# EAGLE design duobackpane (EAGLE 7.7.0)
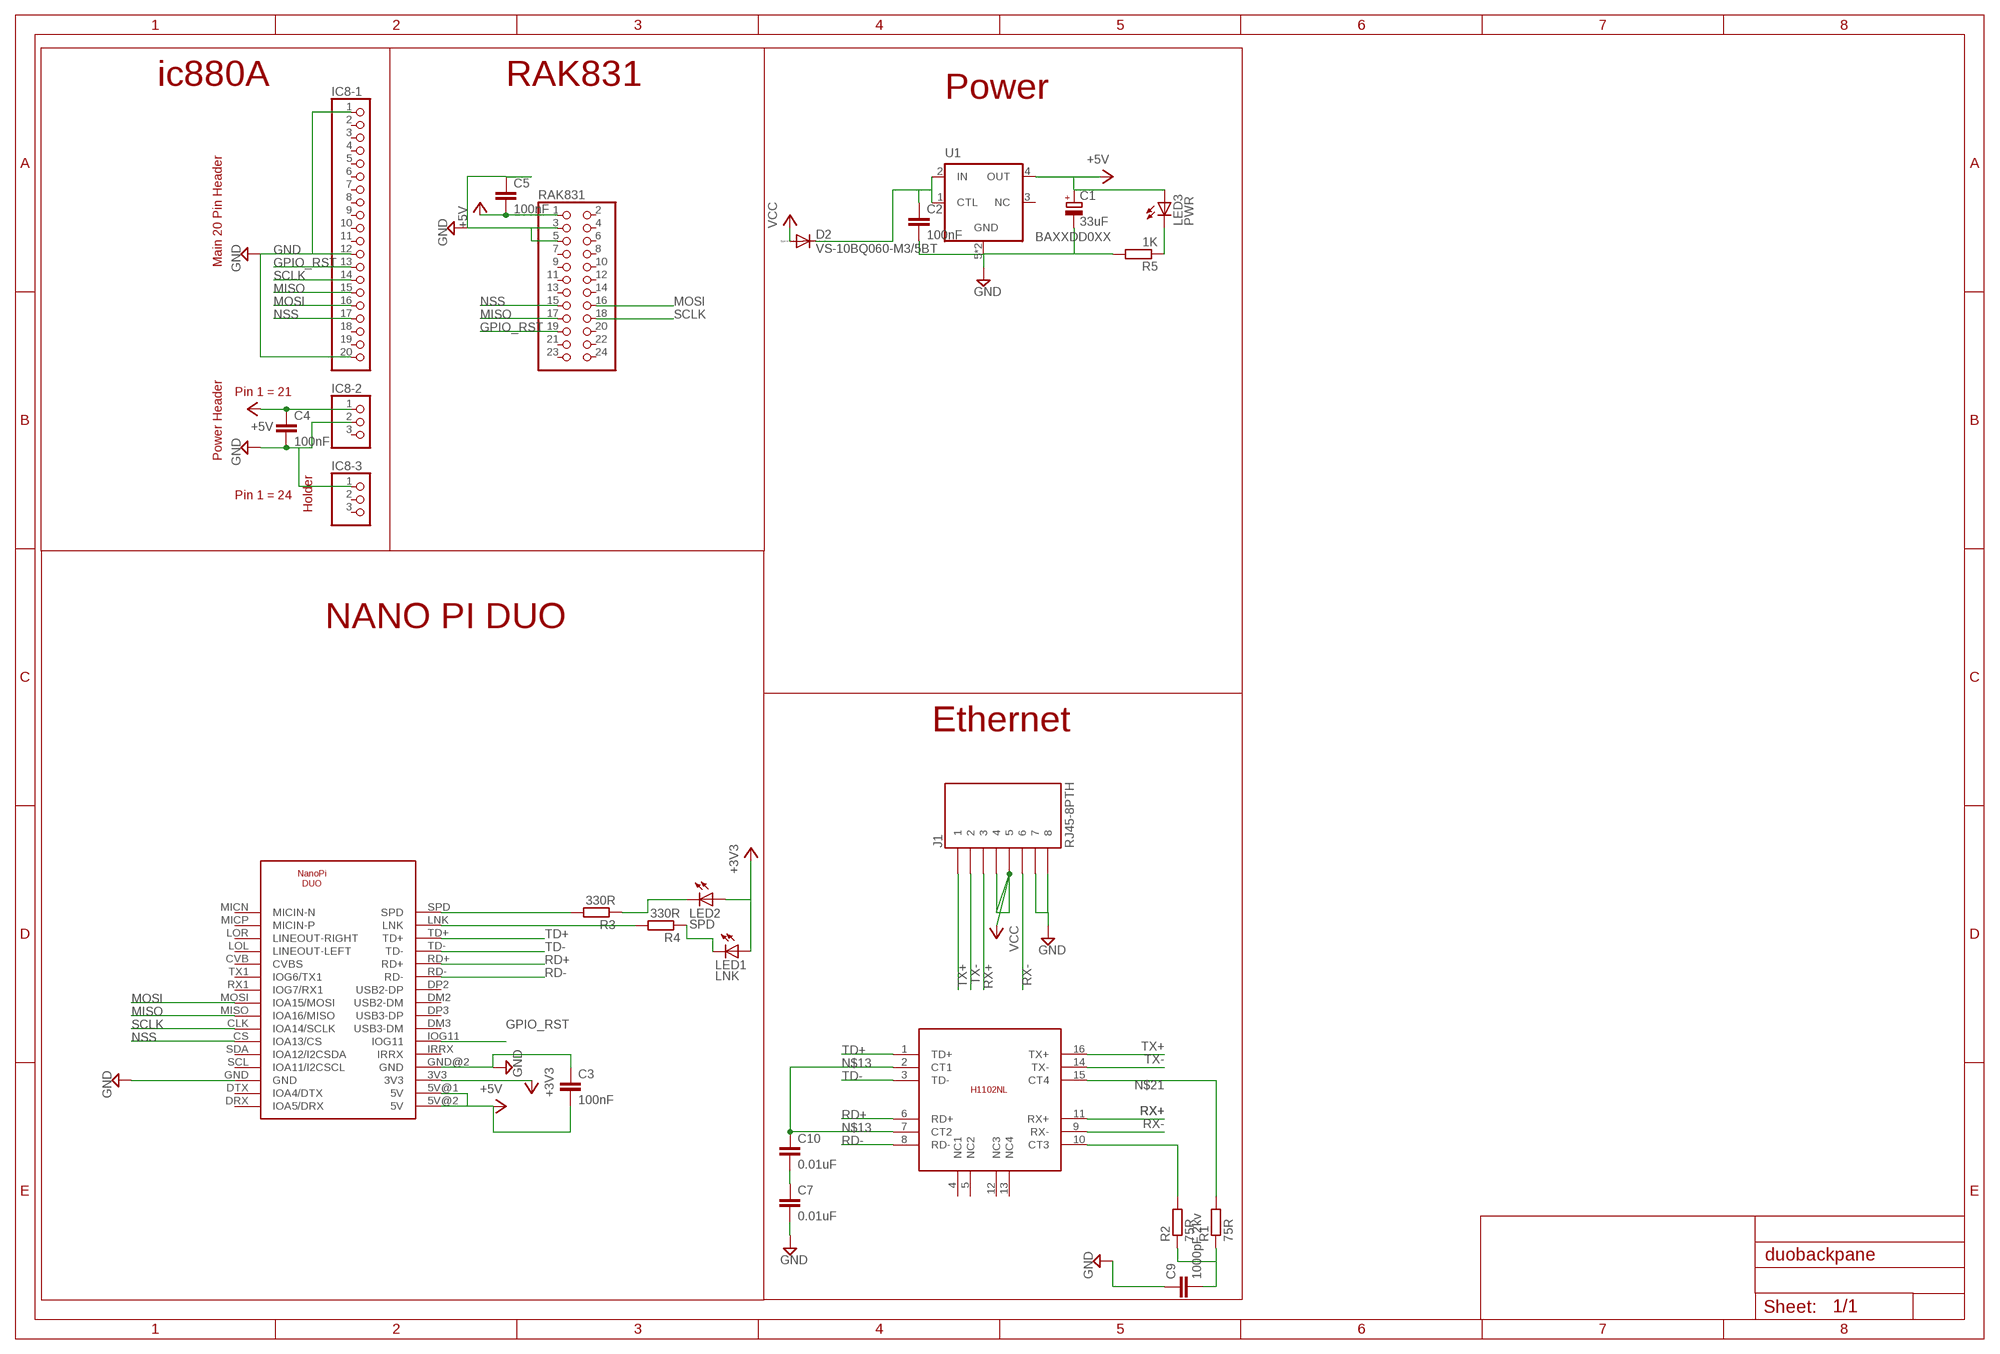
[diagram p0: schematic, sheet 1]

## Parts
C1  33uF  CPOL-EUSMCA  [SMC_A]
C2  100nF  C-EUC0805  [C0805]
C3  100nF  C-EUC0805  [C0805]
C4  100nF  C-EUC0805  [C0805]
C5  100nF  C-EUC0805  [C0805]
C7  0.01uF  C-EUC0805  [C0805]
C9  1000pF 2kv  C-EUC1206  [C1206]
C10  0.01uF  C-EUC0805  [C0805]
D2  VS-10BQ060-M3/5BT  DIODE-DO214AA  [DO214AA]
IC8-1  PINHD-1X20  [1X20]
IC8-2  PINHD-1X3  [1X03]
IC8-3  PINHD-1X3  [1X03]
J1  RJ45-8PTH  [RJ45-8]
LED1  LNK  LEDSML1206  [SML1206]
LED2  SPD  LEDSML1206  [SML1206]
LED3  PWR  LEDSML1206  [SML1206]
R1  75R  R-EU_R0805  [R0805]
R2  75R  R-EU_R0805  [R0805]
R3  330R  R-EU_R0805  [R0805]
R4  330R  R-EU_R0805  [R0805]
R5  1K  R-EU_R0805  [R0805]
RAK831  PINHD-2X12  [2X12]
U1  BAXXDD0XX  [HRP5]
U$1  DECADE-H1102NL  [DECADE-H1102NL]
U$2  NANOPIDUO  [NANOPIDUO]

## Nets
+3V3: LED1.A LED2.A U$2.3V3
+5V: C1.+ C3.2 C4.1 C5.2 IC8-2.1 LED3.A RAK831.1 U1.4(OUT) U$2.5V@1(5V) U$2.5V@2(5V)
GND: C1.- C2.2 C3.1 C4.2 C5.1 C7.2 C9.1 IC8-1.1 IC8-1.12 IC8-1.20 IC8-2.2 IC8-3.1 J1.7 J1.8 R5.2 RAK831.3 RAK831.5 U1.5(GND) U1.6(GND) U$2.GND U$2.GND@2(GND)
GPIO_RST: IC8-1.13 RAK831.19 U$2.IOG11
MISO: IC8-1.15 RAK831.17 U$2.MISO(IOA16/MISO)
MOSI: IC8-1.16 RAK831.16 U$2.MOSI(IOA15/MOSI)
N$1: C2.1 D2.C U1.1(CTL) U1.2(IN)
N$2: R3.2 U$2.SPD
N$3: R4.2 U$2.LNK
N$4: LED2.C R3.1
N$5: R2.2 U$1.10(CT3)
N$6: C9.2 R1.1 R2.1
N$7: LED1.C R4.1
N$8: C7.1 C10.2
N$9: LED3.C R5.1
N$13: C10.1 U$1.2(CT1) U$1.7(CT2)
N$21: R1.2 U$1.15(CT4)
NSS: IC8-1.17 RAK831.15 U$2.CS(IOA13/CS)
RD+: U$1.6(RD+) U$2.RD+
RD-: U$1.8(RD-) U$2.RD-
RX+: J1.3 U$1.11(RX+)
RX-: J1.6 U$1.9(RX-)
SCLK: IC8-1.14 RAK831.18 U$2.CLK(IOA14/SCLK)
TD+: U$1.1(TD+) U$2.TD+
TD-: U$1.3(TD-) U$2.TD-
TX+: J1.1 U$1.16(TX+)
TX-: J1.2 U$1.14(TX-)
VCC: D2.A J1.4 J1.5
Unconnected: IC8-1.2 IC8-1.3 IC8-1.4 IC8-1.5 IC8-1.6 IC8-1.7 IC8-1.8 IC8-1.9 IC8-1.10 IC8-1.11 IC8-1.18 IC8-1.19 IC8-2.3 IC8-3.2 IC8-3.3 RAK831.2 RAK831.4 RAK831.6 RAK831.7 RAK831.8 RAK831.9 RAK831.10 RAK831.11 RAK831.12 RAK831.13 RAK831.14 RAK831.20 RAK831.21 RAK831.22 RAK831.23 RAK831.24 U1.3(NC) U$1.4(NC1) U$1.5(NC2) U$1.12(NC3) U$1.13(NC4) U$2.CVB(CVBS) U$2.DM2(USB2-DM) U$2.DM3(USB3-DM) U$2.DP2(USB2-DP) U$2.DP3(USB3-DP) U$2.DRX(IOA5/DRX) U$2.DTX(IOA4/DTX) U$2.IRRX U$2.LOL(LINEOUT-LEFT) U$2.LOR(LINEOUT-RIGHT) U$2.MICN(MICIN-N) U$2.MICP(MICIN-P) U$2.RX1(IOG7/RX1) U$2.SCL(IOA11/I2CSCL) U$2.SDA(IOA12/I2CSDA) U$2.TX1(IOG6/TX1)

## Notes on the sheet
- ic880A | RAK831
- Power
- Main 20 Pin Header
- Pin 1 = 21
- Power Header
- Pin 1 = 24
- Holder
- NANO PI DUO
- Ethernet

## Library data of the parts
C1 = resistor:CPOL-EU: POLARIZED CAPACITOR, European symbol
C2-C5 C7 C9 C10 = resistor:C-EU: CAPACITOR, European symbol
D2 = diode:DIODE-: DIODE
IC8-1 = pinhead:PINHD-1X20: PIN HEADER
IC8-2 IC8-3 = pinhead:PINHD-1X3: PIN HEADER
J1 = decade:RJ45-8: RJ45 Jack Simple RJ45, 8-pin connection - connector for common Cat5, Cat5e, and Cat6 Ethernet cables. Footprint not yet proven in production. Connector sku is PRT-00643; Breakout PCB sku is BOB-00716.
LED1-LED3 = led:LED: LED OSRAM: - CHIPLED LG R971, LG N971, LY N971, LG Q971, LY Q971, LO R971, LY R971 LH N974, LH R974 LS Q976, LO Q976, LY Q976 LO Q996 - Hyper CHIPLED LW Q18S LB Q993, LB Q99A, LB R99A - SideLED LS A670, LO A670, LY A670, LG A670, LP A670 LB A673, LV A673, LT A673, LW A673 LH A674 LY A675 LS A676, LA A676, LO A676, LY A676, LW A676 LS A679, LY A679, LG A679 - Hyper Micro SIDELED® LS Y876, LA Y876, LO Y876, LY Y876 LT Y87S - SmartLED LW L88C, LW L88S LB L89C, LB L89S, LG L890 LS L89K, LO L89K, LY L89K LS L896, LA L896, LO L896, LY L896 - TOPLED LS T670, LO T670, LY T670, LG T670, LP T670 LSG T670, LSP T670, LSY T670, LOP T670, LYG T670 LG T671, LOG T671, LSG T671 LB T673, LV T673, LT T673, LW T673 LH T674 LS T676, LA T676, LO T676, LY T676, LB T676, LH T676, LSB T676, LW T676 LB T67C, LV T67C, LT T67C, LS T67K, LO T67K, LY T67K, LW E67C LS E67B, LA E67B, LO E67B, LY E67B, LB E67C, LV E67C, LT E67C LW T67C LS T679, LY T679, LG T679 LS T770, LO T770, LY T770, LG T770, LP T770 LB T773, LV T773, LT T773, LW T773 LH T774 LS E675, LA E675, LY E675, LS T675 LS T776, LA T776, LO T776, LY T776, LB T776 LHGB T686 LT T68C, LB T68C - Hyper Mini TOPLED® LB M676 - Mini TOPLED Santana® LG M470 LS M47K, LO M47K, LY M47K Source: http://www.osram.convergy.de LUXEON: - LUMILED® LXK2-PW12-R00, LXK2-PW12-S00, LXK2-PW14-U00, LXK2-PW14-V00 LXK2-PM12-R00, LXK2-PM12-S00, LXK2-PM14-U00 LXK2-PE12-Q00, LXK2-PE12-R00, LXK2-PE12-S00, LXK2-PE14-T00, LXK2-PE14-U00 LXK2-PB12-K00, LXK2-PB12-L00, LXK2-PB12-M00, LXK2-PB14-N00, LXK2-PB14-P00, LXK2-PB14-Q00 LXK2-PR12-L00, LXK2-PR12-M00, LXK2-PR14-Q00, LXK2-PR14-R00 LXK2-PD12-Q00, LXK2-PD12-R00, LXK2-PD12-S00 LXK2-PH12-R00, LXK2-PH12-S00 LXK2-PL12-P00, LXK2-PL12-Q00, LXK2-PL12-R00 Source: www.luxeon.com KINGBRIGHT: KA-3528ASYC Source: www.kingbright.com
R1-R5 = resistor:R-EU_: RESISTOR, European symbol
RAK831 = pinhead:PINHD-2X12: PIN HEADER
U1 = rohm-semi:BAXXDD0XX: LDO REGULATOR
U$1 = DECADE-libraries20151104:DECADE-H1102NL
U$2 = ryanteck:NANOPIDUO

## Board
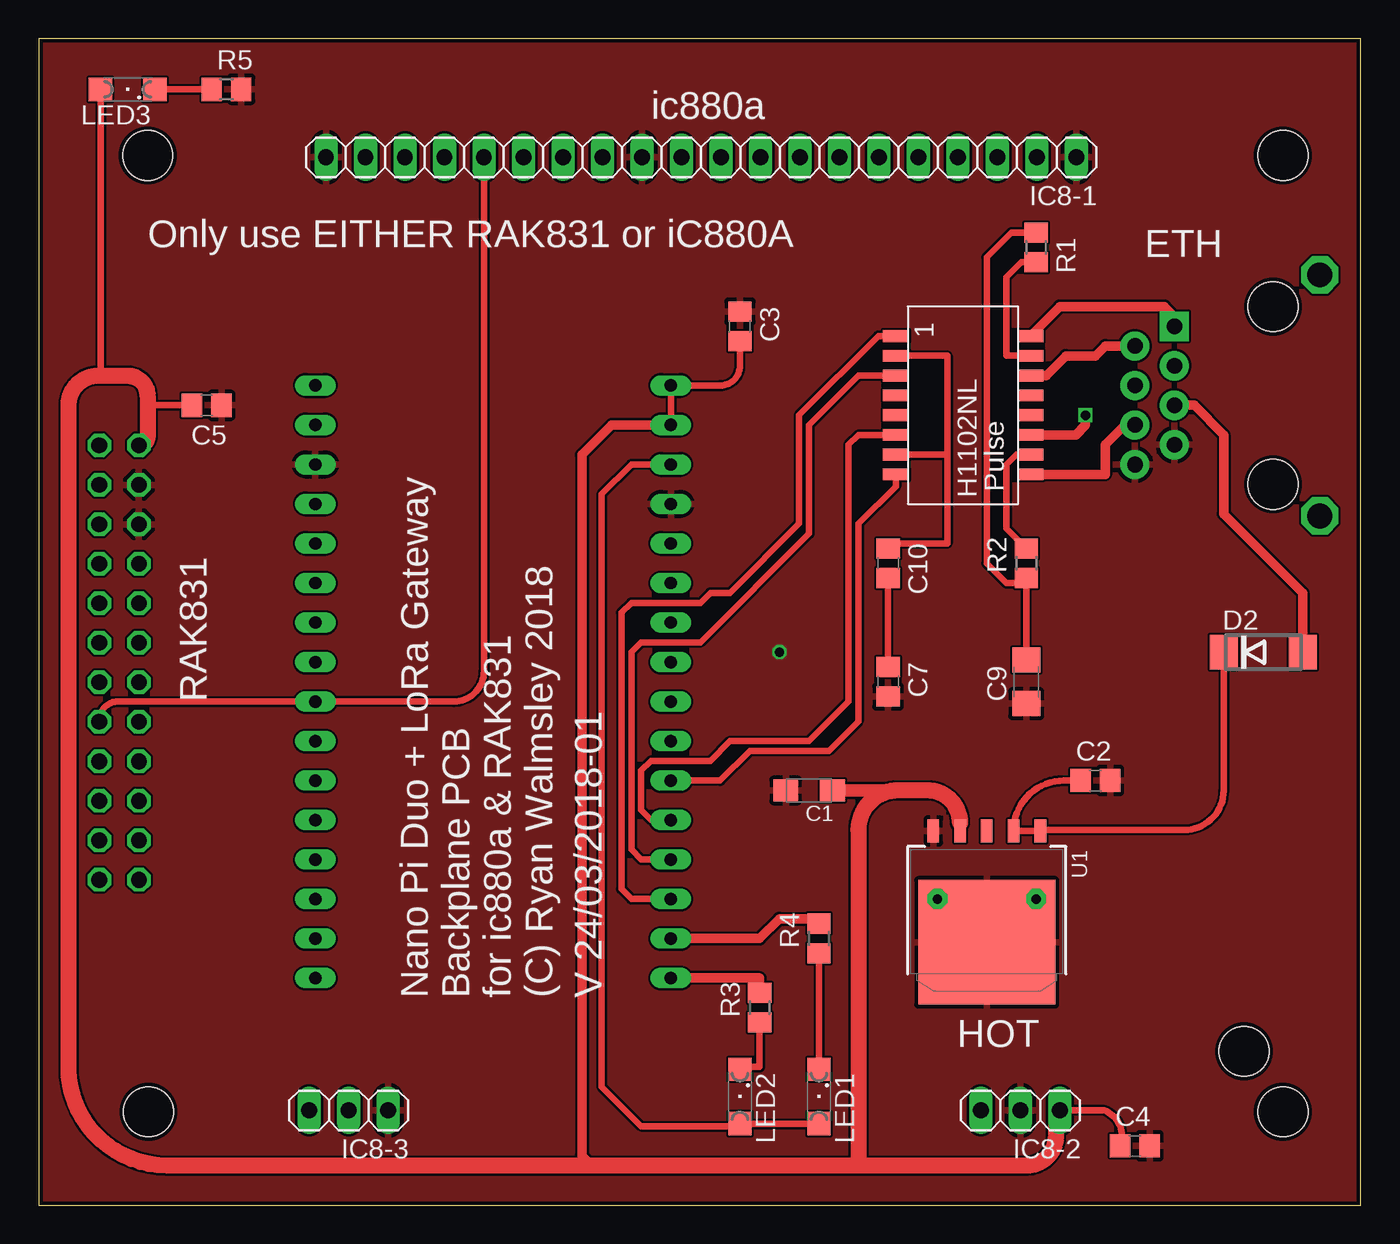
[diagram p1: board, top side]
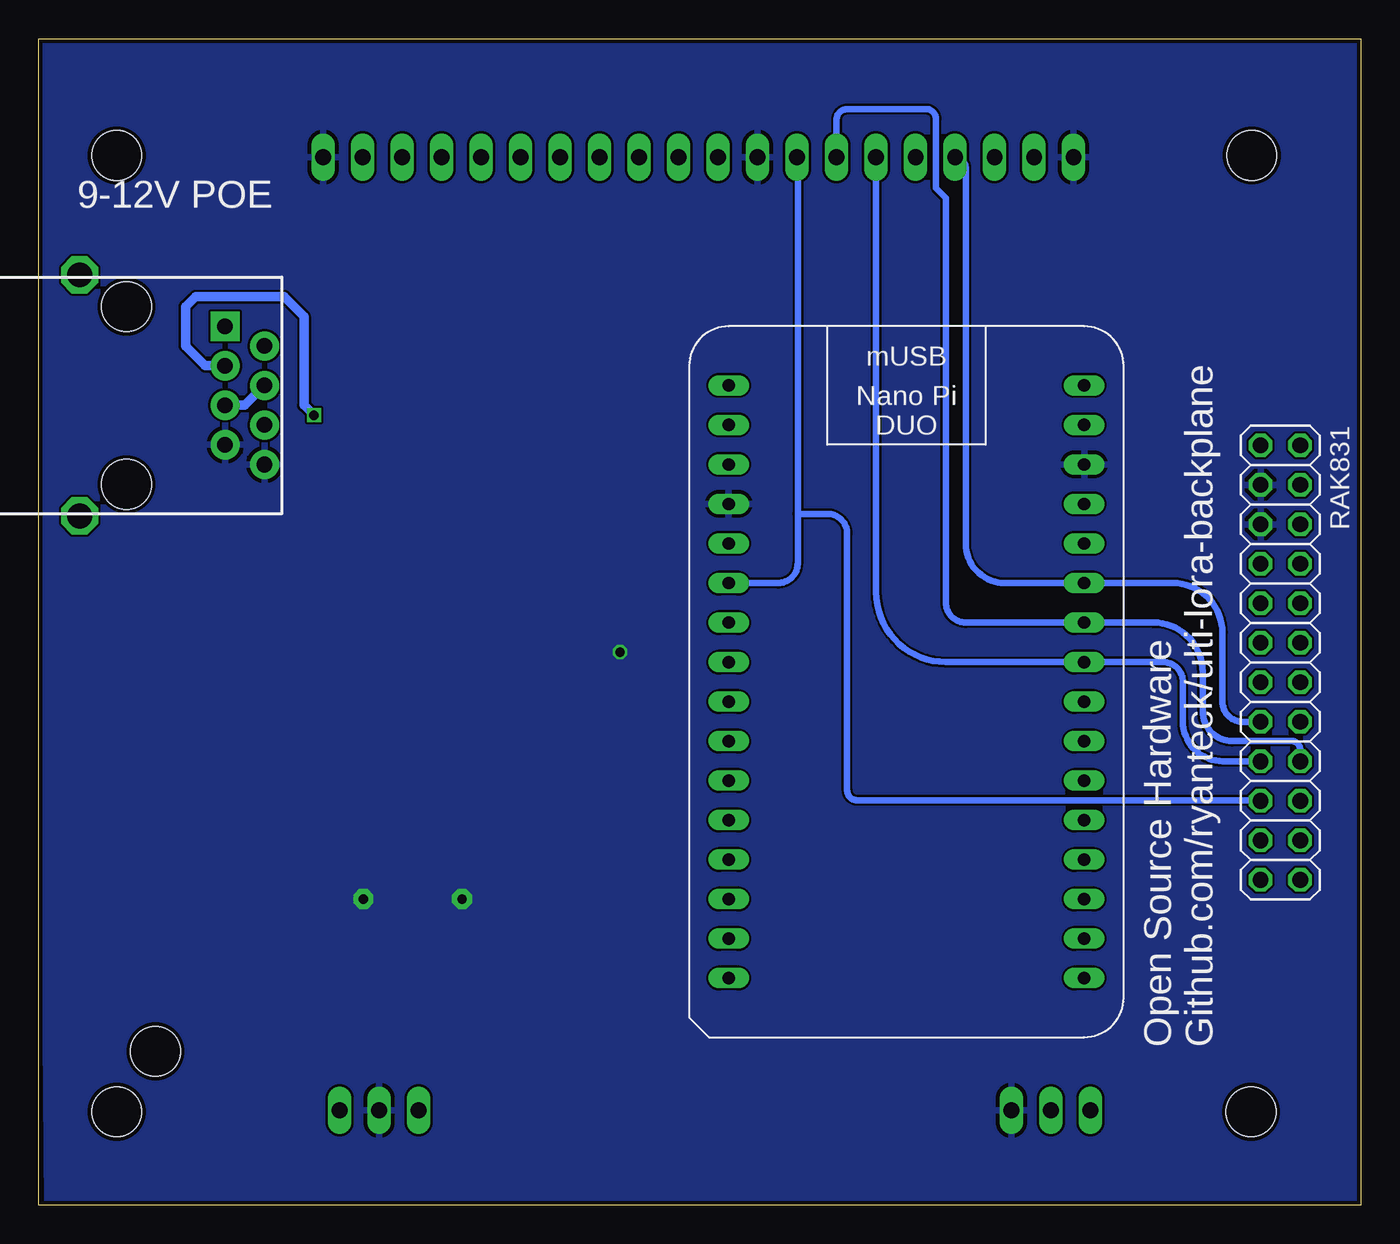
[diagram p2: board, bottom side, seen from below]

Size 85 x 75 mm. Coordinates in mm from the lower left corner, seen from the top.
Outline: 0,0 85,0 85,75 0,75 0,0
Copper layers (1*16): Top 0.035mm / dielectric 1.5mm / Bottom 0.035mm
Design rules "dirt_cheap_dirty_boards.v1.1": minimum track width 6mil, minimum drill 12mil, track to track 6mil, track to pad 6mil, pad to pad 6mil, via to via 6mil, smd to smd 0mil, copper to edge 10mil, drill to drill 10mil, minimum pad ring 10mil, minimum via ring 6mil, stop-mask expansion 2mil, vias tented up to drill 25mil, thermal gap 10mil
Holes 3.2 mm at 77.5,9.89 80,6 80,67.5 7,67.5 7.04,6

### Footprints (pad centres in the part's own frame; a part is rotated, then mirrored left to right if it is on the bottom)
SMC_A = smd 1.6 x 1.4: + -1.5,0; - 1.5,0
C0805 = smd 1.3 x 1.5: 1 -0.95,0; 2 0.95,0
C1206 = smd 1.6 x 1.8: 1 -1.4,0; 2 1.4,0
DO214AA = smd 1.8 x 2.2: A 2.55,0; C -2.55,0
1X20 = drill 1.016 long: 1 -24.13,0; 2 -21.59,0; 3 -19.05,0; 4 -16.51,0; 5 -13.97,0; 6 -11.43,0; 7 -8.89,0; 8 -6.35,0; 9 -3.81,0; 10 -1.27,0; 11 1.27,0; 12 3.81,0; 13 6.35,0; 14 8.89,0; 15 11.43,0; 16 13.97,0; 17 16.51,0; 18 19.05,0; 19 21.59,0; 20 24.13,0
1X03 = drill 1.016 long: 1 -2.54,0; 2 0,0; 3 2.54,0
RJ45-8 = drill 1 pad 1.88 square: 1 -4.445,6.35 | drill 1 pad 1.88: 2 -3.175,8.89; 3 -1.905,6.35; 4 -0.635,8.89; 5 0.635,6.35; 6 1.905,8.89; 7 3.175,6.35; 8 4.445,8.89 | drill 1.6 octagon: P$1 7.75,-3; P$2 -7.75,-3 | hole 3.2: -5.715,0; 5.715,0
SML1206 = smd 1.5 x 1.5: A 1.75,0; C -1.75,0
R0805 = smd 1.3 x 1.5: 1 -0.95,0; 2 0.95,0
2X12 = drill 1.016 octagon: 1 -13.97,-1.27; 2 -13.97,1.27; 3 -11.43,-1.27; 4 -11.43,1.27; 5 -8.89,-1.27; 6 -8.89,1.27; 7 -6.35,-1.27; 8 -6.35,1.27; 9 -3.81,-1.27; 10 -3.81,1.27; 11 -1.27,-1.27; 12 -1.27,1.27; 13 1.27,-1.27; 14 1.27,1.27; 15 3.81,-1.27; 16 3.81,1.27; 17 6.35,-1.27; 18 6.35,1.27; 19 8.89,-1.27; 20 8.89,1.27; 21 11.43,-1.27; 22 11.43,1.27; 23 13.97,-1.27; 24 13.97,1.27
HRP5 = smd 0.75 x 1.5: 1 -3.44,-1.2; 2 -1.72,-1.2; 3 0,-1.2; 4 1.72,-1.2; 5 3.44,-1.2 | smd 8.8 x 8: 6 0,5.96
DECADE-H1102NL = smd 0.76 x 1.67: 1 1.9,-0.77; 2 3.17,-0.77; 3 4.44,-0.77; 4 5.71,-0.77; 5 6.98,-0.77; 6 8.25,-0.77; 7 9.52,-0.77; 8 10.79,-0.77; 9 10.79,7.87; 10 9.52,7.87; 11 8.25,7.87; 12 6.98,7.87; 13 5.71,7.87; 14 4.44,7.87; 15 3.17,7.87; 16 1.9,7.87
NANOPIDUO = drill 0.8 long: 3V3 22.86,5.08; 5V@1 22.86,0; 5V@2 22.86,2.54; CLK 0,15.24; CS 0,12.7; CVB 0,27.94; DM2 22.86,20.32; DM3 22.86,15.24; DP2 22.86,22.86; DP3 22.86,17.78; DRX 0,0; DTX 0,2.54; GND 0,5.08; GND@2 22.86,7.62; IOG11 22.86,12.7; IRRX 22.86,10.16; LNK 22.86,35.56; LOL 0,30.48; LOR 0,33.02; MICN 0,38.1; MICP 0,35.56; MISO 0,17.78; MOSI 0,20.32; RD+ 22.86,27.94; RD- 22.86,25.4; RX1 0,22.86; SCL 0,7.62; SDA 0,10.16; SPD 22.86,38.1; TD+ 22.86,33.02; TD- 22.86,30.48; TX1 0,25.4

### Placement (x,y rotation side)
C1  49.53,26.67 180 top
C2  67.94,27.3 0 top
C3  45.09,56.52 270 top
C4  70.48,3.81 0 top
C5  10.79,51.44 180 top
C7  54.61,33.66 270 top
C9  63.5,33.66 90 top
C10  54.61,41.27 270 top
D2  78.74,35.56 0 top
IC8-1  42.59,67.39 180 top
IC8-2  63.12,6.09 180 top
IC8-3  19.92,6.09 180 top
J1  79.38,52.07 270 bottom
LED1  50.16,6.99 270 top
LED2  45.09,6.99 270 top
LED3  5.71,71.75 180 top
R1  64.14,61.59 270 top
R2  63.5,41.27 90 top
R3  46.35,12.7 90 top
R4  50.16,17.14 90 top
R5  12.06,71.75 0 top
RAK831  5.16,34.89 270 bottom
U1  60.96,22.86 180 top
U$1  55.88,57.78 270 top
U$2  17.78,52.7 180 bottom

### Tracks (layer width: path | path; a pad name or v marks a point on that pad's centre or on a via)
+3V3
  Top 0.406: U$2.3V3 38.1,47.62 36.2,45.72 36.2,7.62 38.73,5.08 44.93,5.08 LED2.A LED1.A
+5V
  Top 0.406: U1.4 59.24,24.58 | U$2.5V@2 U$2.5V@1 43.81,52.7 arc90 45.09,53.98 C3.2 | 6.99,52.07 arc90 7.62,51.44 C5.2 | C4.1 arc90 68.53,6.09 IC8-2.1 | LED3.A 3.96,53.49 3.81,53.34
  Top 0.61: U$2.5V@2 36.83,50.16 34.92,48.26 34.92,3.17 35.56,2.54
  Top 0.813: C1.+ 55.24,26.67
  Top 1.016: IC8-2.1 arc-90 65.41,6.34 65.41,4.45 arc-90 63.5,2.54 52.7,2.54 | 52.7,2.54 35.56,2.54 8.26,2.54 arc-90 1.91,8.89 1.91,51.44 arc-90 3.81,53.34 5.71,53.34 arc-90 6.99,52.07 6.99,49.41 arc-90 RAK831.1 | 59.24,24.58 arc90 57.15,26.67 55.24,26.67 arc90 52.7,24.13 52.7,2.54
GND  (via drill 0.6, 0.6 pad 1.27)
  other vias: 64.14,19.68 57.78,19.68 47.62,35.56
  pour Top: -3.81,-1.27 -3.81,5.08 -2.54,76.2 85.09,75.56 85.09,-0.64 -1.27,-1.27
  pour Bottom: -2.54,0.64 -5.08,-0.64 -1.27,74.93 85.09,75.56 85.09,71.75 84.45,0 -1.91,-0.64
GPIO_RST
  Bottom 0.406: IC8-1.13 arc90 36.2,67.34 36.2,44.45 | 36.2,44.45 36.2,41.27 arc90 37.47,40.01 U$2.IOG11 | RAK831.19 arc-90 6.46,26.04 32.38,26.04 arc90 33.02,26.67 33.02,43.18 arc-90 34.29,44.45 36.2,44.45
MISO
  Bottom 0.406: RAK831.17 8.86,28.54 arc90 11.43,31.11 11.43,33.66 arc-90 12.7,34.92 U$2.MISO 26.67,34.92 arc90 31.16,39.41 IC8-1.15
MOSI
  Top 0.406: RAK831.16 3.89,31.2 arc-90 5.08,32.38 U$2.MOSI 26.67,32.38 arc90 28.62,34.34 IC8-1.16
N$1
  Top 0.406: D2.C 76.19,26.66 arc-90 73.66,24.13 64.47,24.13 arc90 U1.1 U1.2 arc-90 65.92,27.3 C2.1
N$2
  Top 0.61: R3.2 46.35,14.61 U$2.SPD
N$3
  Top 0.61: U$2.LNK 46.35,17.14 47.62,18.41 49.84,18.41 R4.2
N$4
  Top 0.406: R3.1 46.35,8.89 45.09,8.89 LED2.C
N$5
  Top 0.406: U$1.10 62.87,48.27 62.23,47.62 62.23,43.49 R2.2
N$6
  Top 0.406: R1.1 62.55,62.55 60.96,60.96 60.96,41.27 62.23,40.01 63.18,40.01 R2.1 C9.2
N$7
  Top 0.406: R4.1 LED1.C
N$8
  Top 0.406: C7.1 C10.2
N$9
  Top 0.406: LED3.C R5.1
N$13
  Top 0.406: U$1.7 58.42,48.27 | 58.42,48.27 58.42,42.55 54.61,42.55 C10.1 | U$1.2 58.42,54.62 58.42,48.27
N$21
  Top 0.406: U$1.15 62.23,54.62 62.23,59.69 63.19,60.65 R1.2
NSS
  Bottom 0.406: RAK831.15 7.58,31.08 arc90 8.89,32.38 8.89,36.83 arc-90 12.06,40.01 U$2.CS 22.86,40.01 arc90 25.4,42.55 25.4,66.71 arc-90 IC8-1.17
RD+
  Top 0.406: U$2.RD+ 39.37,24.77 38.73,25.4 38.73,27.94 39.37,28.57 43.18,28.57 44.45,29.84 49.53,29.84 52.07,32.38 52.07,48.9 52.71,49.53 U$1.6
RD-
  Top 0.406: U$1.8 55.11,46.22 52.7,43.81 52.7,31.11 50.8,29.21 45.72,29.21 43.81,27.3 U$2.RD-
RX+  (via drill 0.6)
  Top 0.61: v67.31,50.8 67.31,50.16 66.67,49.53 U$1.11
  Bottom 0.61: J1.3 74.3,53.98 75.56,55.24 75.56,57.78 74.93,58.42 69.22,58.42 67.94,57.15 67.94,51.44 v67.31,50.8
RX-
  Top 0.61: J1.6 69.85,50.16 68.58,48.9 68.58,46.99 U$1.9
SCLK
  Bottom 0.406: RAK831.18 3.89,29.29 arc-90 4.45,29.84 8.26,29.84 arc90 10.16,31.75 10.16,34.29 arc-90 13.34,37.47 U$2.CLK 25.4,37.47 arc90 26.67,38.73 26.67,64.77 27.3,65.41 27.3,69.85 arc-90 27.94,70.48 33.02,70.48 arc-90 33.7,69.81 IC8-1.14
TD+
  Top 0.406: U$1.1 53.98,55.88 48.9,50.8 48.9,43.81 44.45,39.37 43.18,39.37 42.55,38.73 38.1,38.73 37.47,38.1 37.47,20.32 38.1,19.68 U$2.TD+
TD-
  Top 0.406: U$1.3 52.71,53.34 49.53,50.16 49.53,43.18 42.55,36.2 38.73,36.2 38.1,35.56 38.1,22.86 38.73,22.23 U$2.TD-
TX+
  Top 0.61: J1.1 73.03,57.15 72.39,57.78 65.65,57.78 U$1.16
TX-
  Top 0.61: U$1.14 64.78,53.34 66.04,54.61 67.94,54.61 68.58,55.24 J1.2
VCC
  Top 0.61: J1.5 74.3,51.44 76.2,49.53 76.2,44.45 81.28,39.37 D2.A
  Bottom 0.61: J1.4 71.75,51.44 J1.5

### Text on the board
tNames: ic880a | Only use EITHER RAK831 or iC880A | ETH | RAK831 | Nano Pi Duo + LoRa Gateway / Backplane PCB / for ic880a & RAK831 / (C) Ryan Walmsley 2018 | V 24/03/2018-01 | HOT
bNames: 9-12V POE | Open Source Hardware / Github.com/ryanteck/ulti-lora-backplane